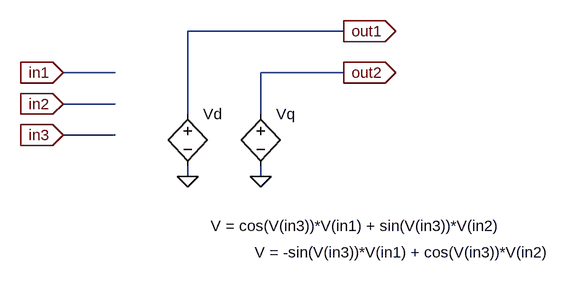
[diagram p0: schematic Fwd_Park.asc]
Fwd_Park.asc, the LTspice schematic file:
Version 4
SHEET 1 1224 680
WIRE 320 64 80 64
WIRE -32 128 -112 128
WIRE 320 128 192 128
WIRE -32 176 -112 176
WIRE 80 192 80 64
WIRE 192 192 192 128
WIRE -32 224 -112 224
WIRE 80 288 80 272
WIRE 192 288 192 272
FLAG -112 128 in1
IOPIN -112 128 In
FLAG -112 176 in2
IOPIN -112 176 In
FLAG -112 224 in3
IOPIN -112 224 In
FLAG 80 288 0
FLAG 192 288 0
FLAG 320 64 out1
IOPIN 320 64 Out
FLAG 320 128 out2
IOPIN 320 128 Out
SYMBOL bv 80 176 R0
WINDOW 3 35 188 Left 0
SYMATTR Value V = cos(V(in3))*V(in1) + sin(V(in3))*V(in2)
SYMATTR InstName Vd
SYMBOL bv 192 176 R0
WINDOW 3 -9 229 Left 0
SYMATTR Value V = -sin(V(in3))*V(in1) + cos(V(in3))*V(in2)
SYMATTR InstName Vq

The netlist it stands for:
* Fwd_Park.asc
B§Vd out1 0 V = cos(V(in3))*V(in1) + sin(V(in3))*V(in2)
B§Vq out2 0 V = -sin(V(in3))*V(in1) + cos(V(in3))*V(in2)
.backanno
.end